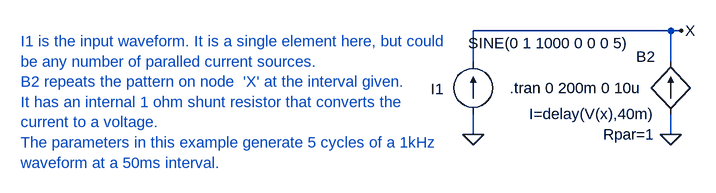
[diagram p0: schematic Sine burst 3.asc]
Sine burst 3.asc, the LTspice schematic file:
Version 4
SHEET 1 1892 680
WIRE 1152 32 848 32
WIRE 1168 32 1152 32
WIRE 848 80 848 32
WIRE 1152 80 1152 32
WIRE 848 192 848 160
WIRE 1152 192 1152 160
FLAG 1152 192 0
FLAG 848 192 0
FLAG 1168 32 X
SYMBOL bi 1152 160 R180
WINDOW 0 24 88 Left 0
WINDOW 3 24 0 Left 0
WINDOW 123 24 -32 Left 0
SYMATTR InstName B2
SYMATTR Value I=delay(V(x),40m)
SYMATTR Value2 Rpar=1
SYMBOL current 848 160 R180
WINDOW 0 45 38 Left 0
WINDOW 3 -240 109 Left 0
WINDOW 123 0 0 Left 0
WINDOW 39 0 0 Left 0
SYMATTR InstName I1
SYMATTR Value SINE(0 1 1000 0 0 0 5)
TEXT 904 120 Left 0 !.tran 0 200m 0 10u
TEXT 152 48 Left 0 ;I1 is the input waveform. It is a single element here, but could \nbe any number of paralled current sources.\nB2 repeats the pattern on node  'X' at the interval given.\nIt has an internal 1 ohm shunt resistor that converts the \ncurrent to a voltage.\nThe parameters in this example generate 5 cycles of a 1kHz\nwaveform at a 50ms interval.

The netlist it stands for:
* Sine burst 3.asc
B2 0 X I=delay(V(x),40m) Rpar=1
I1 0 X SINE(0 1 1000 0 0 0 5)
.tran 0 200m 0 10u
* I1 is the input waveform. It is a single element here, but could
* be any number of paralled current sources.
* B2 repeats the pattern on node  'X' at the interval given.
* It has an internal 1 ohm shunt resistor that converts the
* current to a voltage.
* The parameters in this example generate 5 cycles of a 1kHz
* waveform at a 50ms interval.
.backanno
.end